# EAGLE design switch (EAGLE 6.5.0)
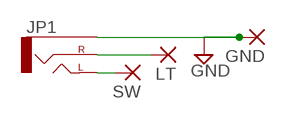
[diagram p0: schematic, sheet 1]

## Parts
GND  2,15/1,0  [2,15/1,0]
JP1  AUDIO-JACKPTH  [AUDIO-JACK]
LT  2,15/1,0  [2,15/1,0]
SW  2,15/1,0  [2,15/1,0]

## Nets
GND: GND.1(P) JP1.SLEEVE
N$1: JP1.RING(RIGHT) LT.1(P)
N$2: JP1.TIP(LEFT) SW.1(P)

## Library data of the parts
GND LT SW = wirepad:2,15/1,0: THROUGH-HOLE PAD
JP1 = SparkFun-Connectors:AUDIO-JACK: 3.5mm Audio Jack Simple 3.5mm common PCB mount audio jack. SKU: PRT-08032

## Net classes
0 default: width 0.305 mm, drill 0.508 mm, clearance 0.254 mm

## Board
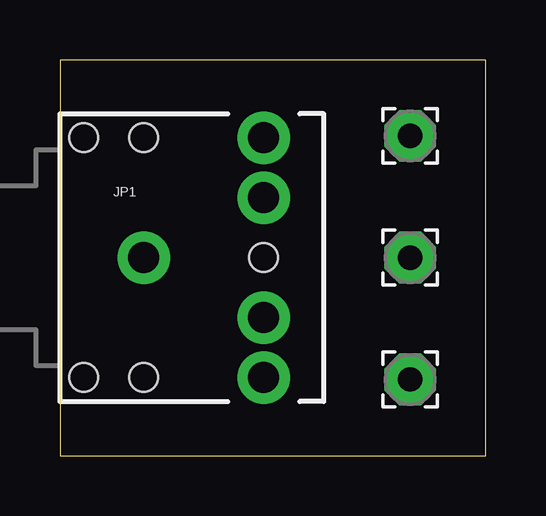
[diagram p1: board, top side]
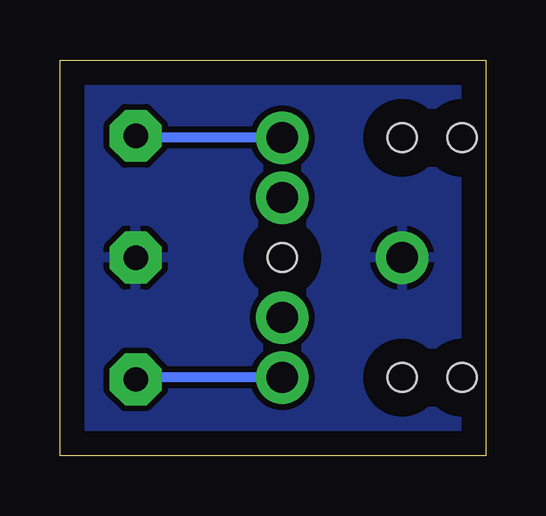
[diagram p2: board, bottom side, seen from below]

Size 17.77 x 16.5 mm. Coordinates in mm from the lower left corner, seen from the top.
Outline: 0,0 17.77,0 17.77,16.5 0,16.5 0,0
Copper layers (1*16): Top 0.035mm / dielectric 1.5mm / Bottom 0.035mm
Design rules "default": minimum track width 10mil, minimum drill 24mil, track to track 8mil, track to pad 8mil, pad to pad 8mil, via to via 8mil, smd to smd 8mil, copper to edge 40mil, drill to drill 8mil, minimum pad ring 10mil, minimum via ring 8mil, stop-mask expansion 4mil, vias tented up to drill 0mil, thermal gap 10mil

### Footprints (pad centres in the part's own frame; a part is rotated, then mirrored left to right if it is on the bottom)
2,15/1,0 = drill 1.016 pad 2.159 octagon: 1 0,0
AUDIO-JACK = drill 1.3 pad 2.184: RING 5,5; RSH 5,2.5; SLEEVE 0,0; TIP 5,-5; TSH 5,-2.5 | hole 1.2: 0,5; -2.5,5; -2.5,-5; 0,-5; 5,0

### Placement (x,y rotation side)
GND  14.61,8.26 0 top
JP1  3.49,8.26 0 top
LT  14.61,13.34 0 top
SW  14.61,3.17 0 top

### Tracks (layer width: path | path; a pad name or v marks a point on that pad's centre or on a via)
GND
  pour Bottom: 0,16.51 17.78,16.51 17.78,0 0,0
N$1
  Bottom 0.406: JP1.RING 14.61,13.26 LT.1
N$2
  Bottom 0.406: JP1.TIP 14.61,3.25 SW.1